# Altium schematic sheet intanRHS2116.SchDoc
size A4
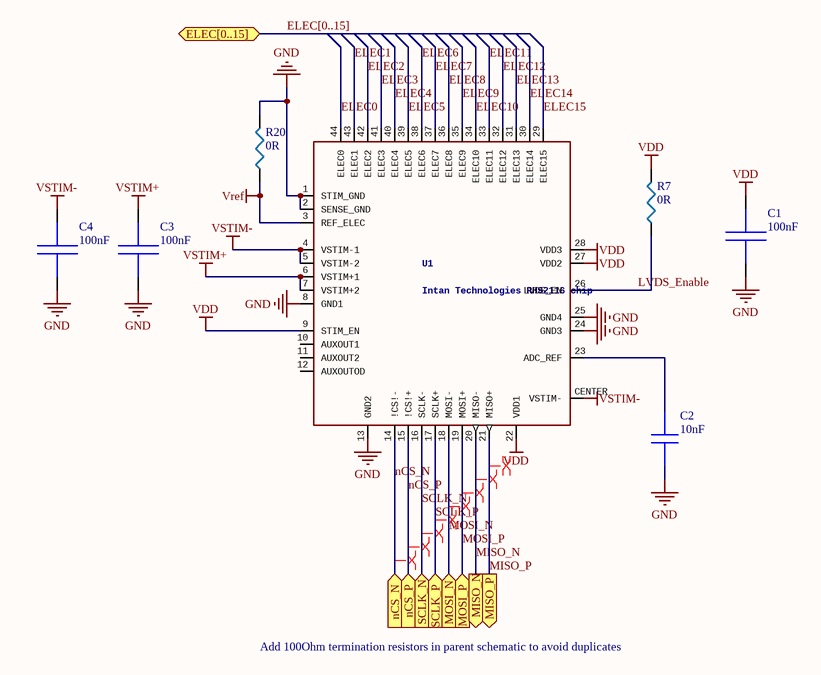
[diagram p0: intanRHS2116.SchDoc]

## Parts
C1  value 100nF  [rcl_0402i_1005m_most]  (hidden comment: capacitor_npol_ame)
C2  value 10nF  [rcl_0402i_1005m_most]  (hidden comment: capacitor_npol_ame_10n)
C3  value 100nF  [rcl_0402i_1005m_most]  (hidden comment: capacitor_npol_ame)
C4  value 100nF  [rcl_0402i_1005m_most]  (hidden comment: capacitor_npol_ame)
R7  0R  [rcl_0402i_1005m_most]
R20  0R  [rcl_0402i_1005m_most]
U1  Intan Technologies RHS2116 chip  [QFN44_7_X_7]

## Ports
ELEC[0..15] (bidir), MISO_N (out), MISO_P (out), MOSI_N (in), MOSI_P (in), nCS_N (in), nCS_P (in), SCLK_N (in), SCLK_P (in)

## Nets
GND: C1.1 C2.1 C3.1 C4.1 R20.2 U1.1(STIM_GND) U1.2(SENSE_GND) U1.8(GND1) U1.13(GND2) U1.24(GND3) U1.25(GND4)
VDD: C1.2 R7.2 U1.9(STIM_EN) U1.22(VDD1) U1.27(VDD2) U1.28(VDD3)
Vref: R20.1 U1.3(REF_ELEC)
VSTIM+: C3.2 U1.6(VSTIM+1) U1.7(VSTIM+2)
VSTIM-: C4.2 U1.4(VSTIM-1) U1.5(VSTIM-2) U1.CENTER(VSTIM-)
ELEC0: U1.44(ELEC0)
ELEC1: U1.43(ELEC1)
ELEC2: U1.42(ELEC2)
ELEC3: U1.41(ELEC3)
ELEC4: U1.40(ELEC4)
ELEC5: U1.39(ELEC5)
ELEC6: U1.38(ELEC6)
ELEC7: U1.37(ELEC7)
ELEC8: U1.36(ELEC8)
ELEC9: U1.35(ELEC9)
ELEC10: U1.34(ELEC10)
ELEC11: U1.33(ELEC11)
ELEC12: U1.32(ELEC12)
ELEC13: U1.31(ELEC13)
ELEC14: U1.30(ELEC14)
ELEC15: U1.29(ELEC15)
LVDS_Enable: R7.1 U1.26(LVDS_EN)
MISO_N: U1.20(MISO-) ; port MISO_N
MISO_P: U1.21(MISO+) ; port MISO_P
MOSI_N: U1.18(MOSI-) ; port MOSI_N
MOSI_P: U1.19(MOSI+) ; port MOSI_P
nCS_N: U1.14(!CS!-) ; port nCS_N
nCS_P: U1.15(!CS!+) ; port nCS_P
SCLK_N: U1.16(SCLK-) ; port SCLK_N
SCLK_P: U1.17(SCLK+) ; port SCLK_P
NetC2_2: C2.2 U1.23(ADC_REF)

Not connected (* = marked no-connect by the designer): U1 10(AUXOUT1) 11(AUXOUT2) 12(AUXOUTOD)

## Buses and harness runs
bus ELEC[0..15] = port ELEC[0..15]

## Layout directives
differential pair: MISO_N, MISO_P, MOSI_N, MOSI_P, nCS_N, nCS_P, SCLK_N, SCLK_P

## Notes on the sheet
- Add 100Ohm termination resistors in parent schematic to avoid duplicates

## Library data of the parts
C1 C4 = capacitor_npol_ame: Capacitor Non-polarized American Symbol; Manufacturer: Yageo; Manuracturer Part Number: CC0402KRX7R8BB104; Voltage Rating: 25V; Priging 1: 1 	0.15000 	$0.15 (CAD); Package: 0402; Supplier 1: Digikey; Supplier Part Number 1: 311-2077-1-ND; Supplier Link 1: https://www.digikey.ca/product-detail/en/yageo/CC0402KRX7R8BB104/311-2077-1-ND/5698948; Stock 1: 143,749; ComponentLink1URL: http://www.yageo.com/documents/recent/UPY-GPHC_X7R_6.3V-to-50V_18.pdf; ComponentLink1Description: Datasheet; Supplier Description 1: CAP CER 0.1UF 25V X7R 0402
C2 = capacitor_npol_ame_10n: Capacitor Non-polarized American Symbol; Manufacturer: Murata Electronics North America; Manufacturer Part Number: GRM155R71H103KA88D; Tolerance: 10%; Voltage Rating: 25V; Case Code: 0402; ComponentLink1Description: Reference Sheet; ComponentLink1URL: https://www.murata.com/~/media/webrenewal/support/library/catalog/products/capacitor/mlcc/c02e.ashx?la=en-us; Pricing 1: Free; Stock 1: 8970712; Supplier 1: 7PCB/Bittele; Supplier Description 1: CAP CER 0.01uF ±10% 50V X7R 0402; Supplier Link 1: https://parts.7pcb.com/; Supplier Part Number 1: GRM155R71H103KA88D
C3 = capacitor_npol_ame: Capacitor Non-polarized American Symbol; Manufacturer: Yageo; Manufacturer PN: CC0402KRX7R8BB104; Voltage Rating: 25V; Priging 1: 1 	0.15000 	$0.15 (CAD); Package: 0402; Supplier 1: Digikey; Supplier Part Number 1: 311-2077-1-ND; Supplier Link 1: https://www.digikey.ca/product-detail/en/yageo/CC0402KRX7R8BB104/311-2077-1-ND/5698948; Stock 1: 143,749; ComponentLink1URL: http://www.yageo.com/documents/recent/UPY-GPHC_X7R_6.3V-to-50V_18.pdf; ComponentLink1Description: Datasheet; Supplier Description 1: CAP CER 0.1UF 25V X7R 0402; Manufacturer Part Number: CC0402KRX7R8BB104
R7 R20 = RES100: RES SMD 0 OHM JUMPER 1/16W 0402; Manufacturer: Vishay Dale; Manufacturer Part Number: CRCW04020000Z0ED; Tolerance 1: 1%; Resistance: 100R; Temperature Coefficient: 100ppm/°C; Power Rating: 0.063W; Voltage Rating: 50V; Tolorance 2: 0.5%; Supplier 1: 7PCB/Bittle; Stock 1: 1271266; Pricing 1: Free; Case/Package: 0402; Case Code (Metric): 1005; Case Code (Imperial): 0402; Min Operating Temperature: -55°C; Max Operating Temperature: 155°C; Packaging: Paper Tape; Composition: Thick Film; Package Quantity: 1; Number of Terminations: 2; Termination: SMD/SMT; Military Standard: Not; Max Power Dissipation: 0.063W; REACH SVHC: Unknown; Lead Free: Lead Free; ComponentLink1URL: http://www.vishay.com/docs/20035/dcrcwe3.pdf; ComponentLink1Description: Datasheet 1; Supplier Part Number 1: CRCW04020000Z0ED; Length: 1mm; Width: 0.5mm; Supplier Link 1: https://parts.7pcb.com/; Supplier Description 1: RES SMD 0.0OHM JUMPER 1/16W 0402; Height: 0.4mm
U1 = RHS2116_QFN: ComponentLink1Discription: Datasheet; ComponentLink2Discription: Bare Die; Pricing 1: 1-24=325;  25-99=278;  100-249=233;  250-499=188;  500-999=151  (USD); Supplier 1: Intan; Manufacturer: Intan Technologies; Manufacturer Part Number: RHS2116; Supplier Part Number 1: RHS2116; ComponentLink1URL: http://intantech.com/files/Intan_RHS2116_datasheet.pdf; ComponentLink2URL: http://intantech.com/files/RHS2116_die_diagram.pdf; Supplier Link 1: http://intantech.com/products_RHS2000.html